# Altium schematic sheet COVER PAGE.SchDoc
size A3; SheetNumber: 2; SheetTotal: 5
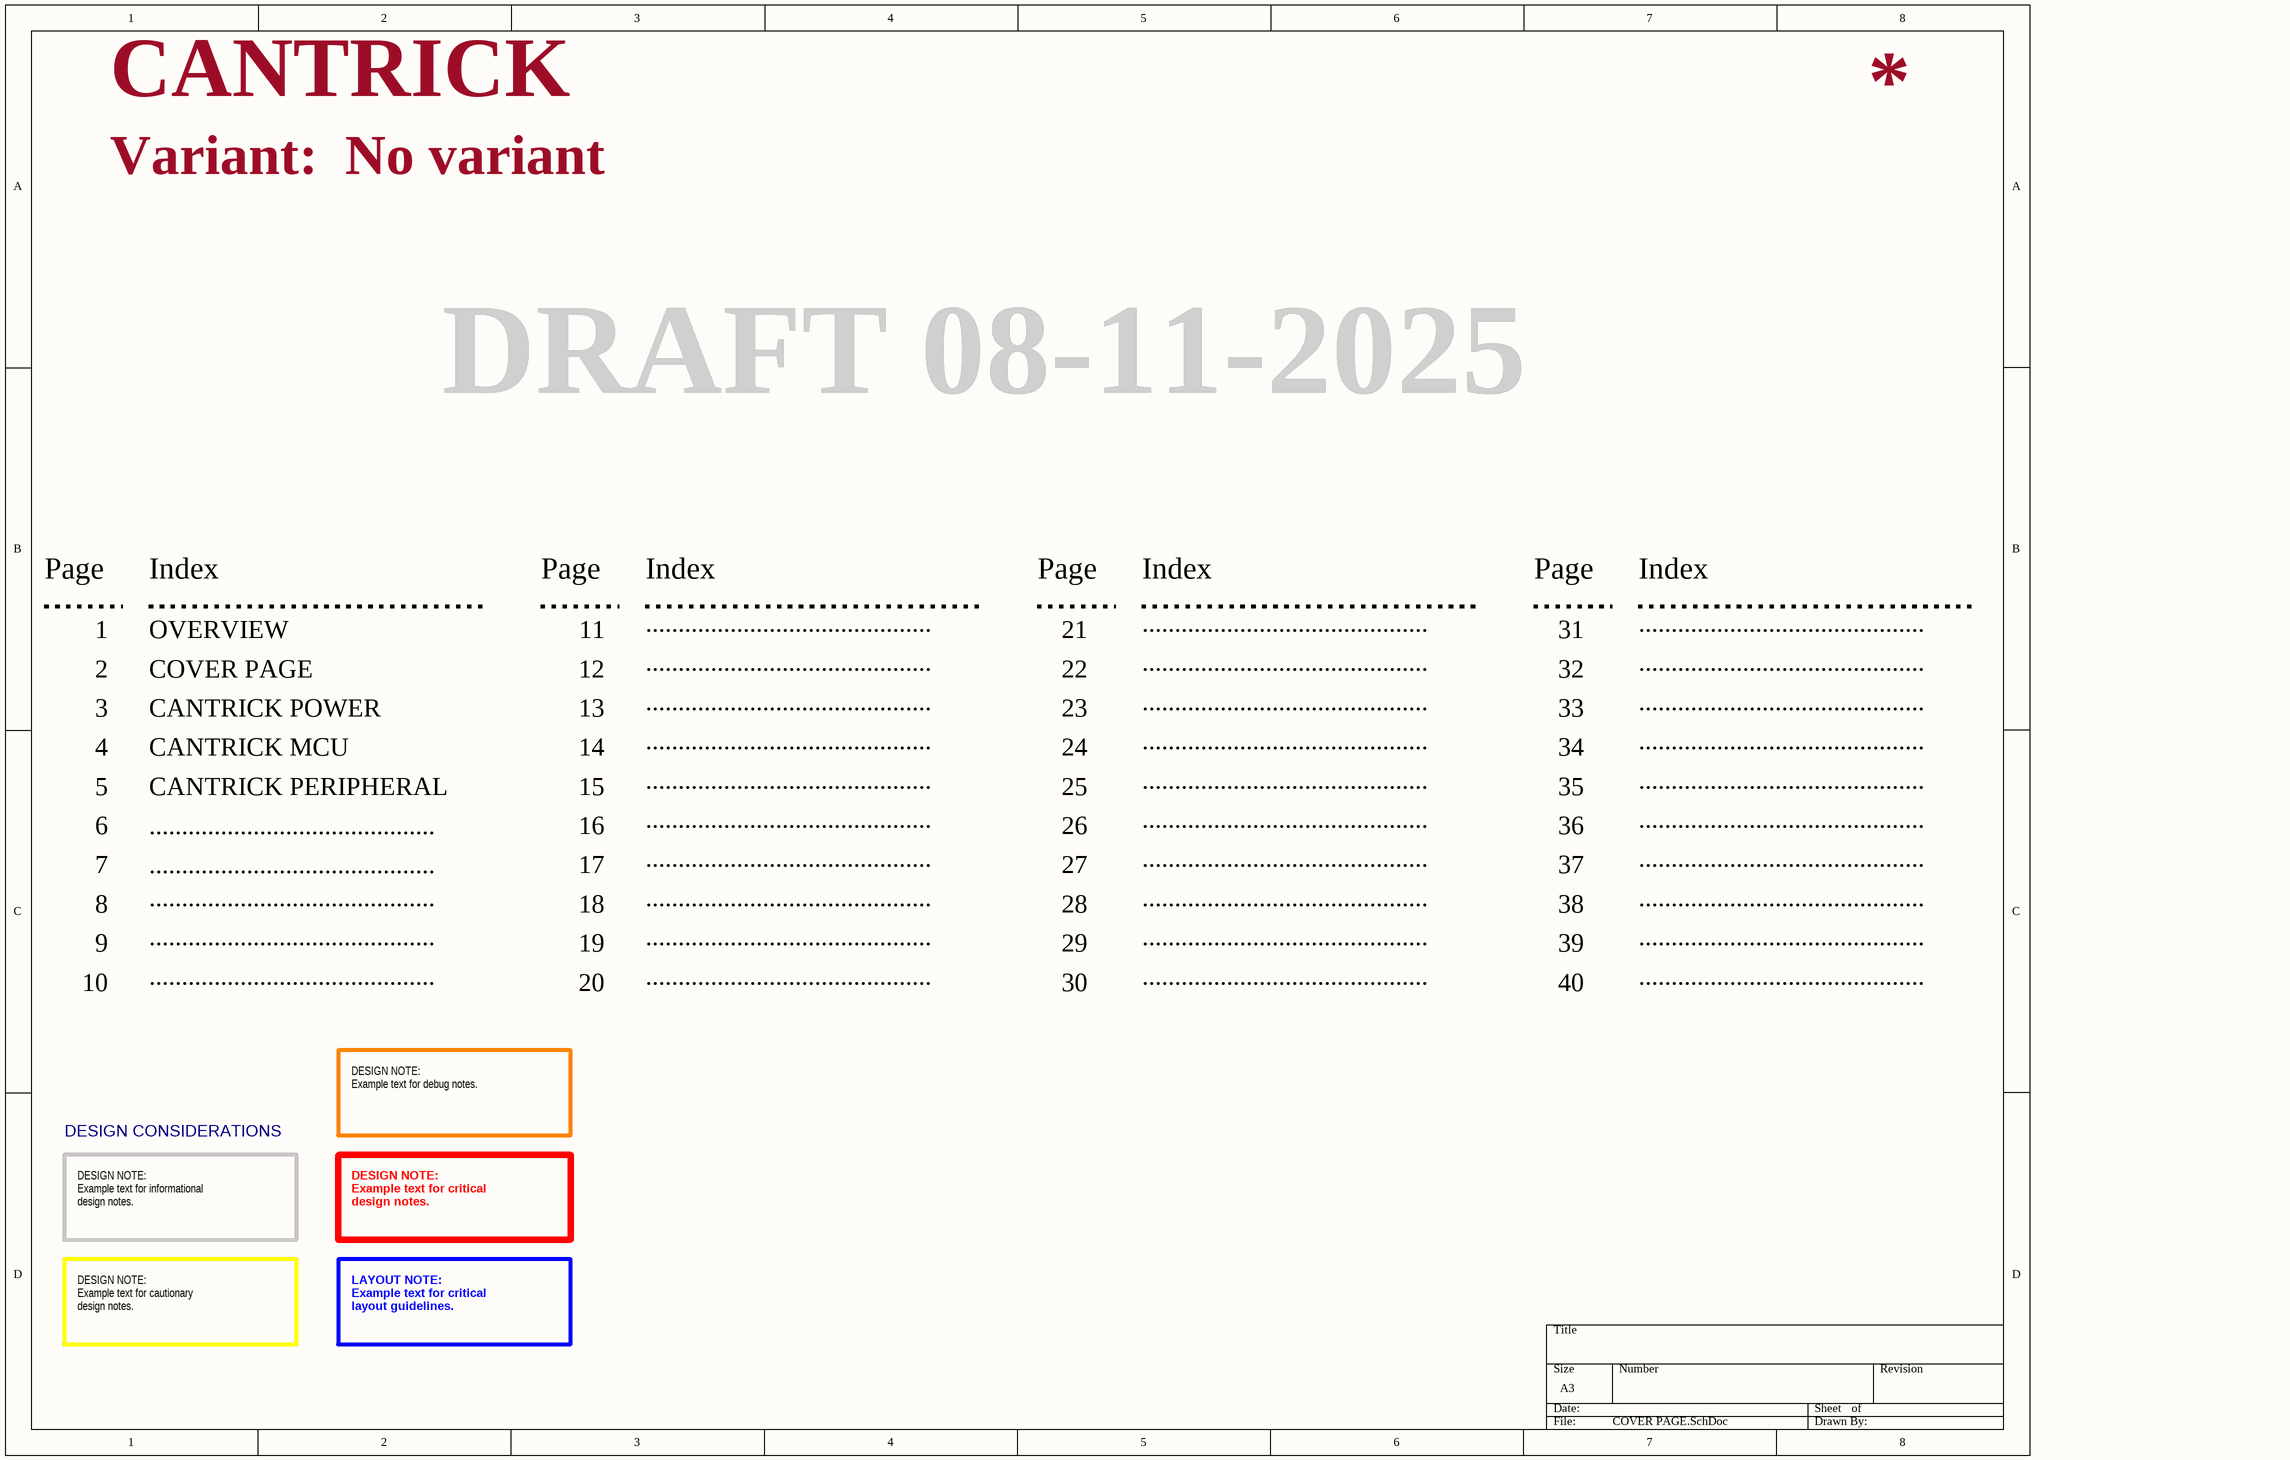
[diagram p0: COVER PAGE.SchDoc]

## Notes on the sheet
- CANTRICK
- Variant:
- No variant
- DRAFT 08-11-2025
- Page
- Index
- 1
- 2
- OVERVIEW
- COVER PAGE
- 12
- 11
- ............................................
- 21
- 22
- 31
- 32
- 3
- 4
- CANTRICK POWER
- CANTRICK MCU
- 13
- 14
- 23
- 24
- 33
- 34
- 5
- CANTRICK PERIPHERAL
- 15
- 25
- 35
- 6
- 7
- 16
- 17
- 26
- 27
- 36
- 37
- 8
- 9
- 18
- 19
- 28
- 29
- 38
- 39
- 10
- 20
- 30
- 40
- DESIGN CONSIDERATIONS
- DESIGN NOTE:
  Example text for debug notes.
- DESIGN NOTE:
  Example text for informational
  design notes.
- DESIGN NOTE:
  Example text for critical
  design notes.
- DESIGN NOTE:
  Example text for cautionary
  design notes.
- LAYOUT NOTE:
  Example text for critical
  layout guidelines.